# Altium schematic sheet Motors_Sheet.SchDoc
size A
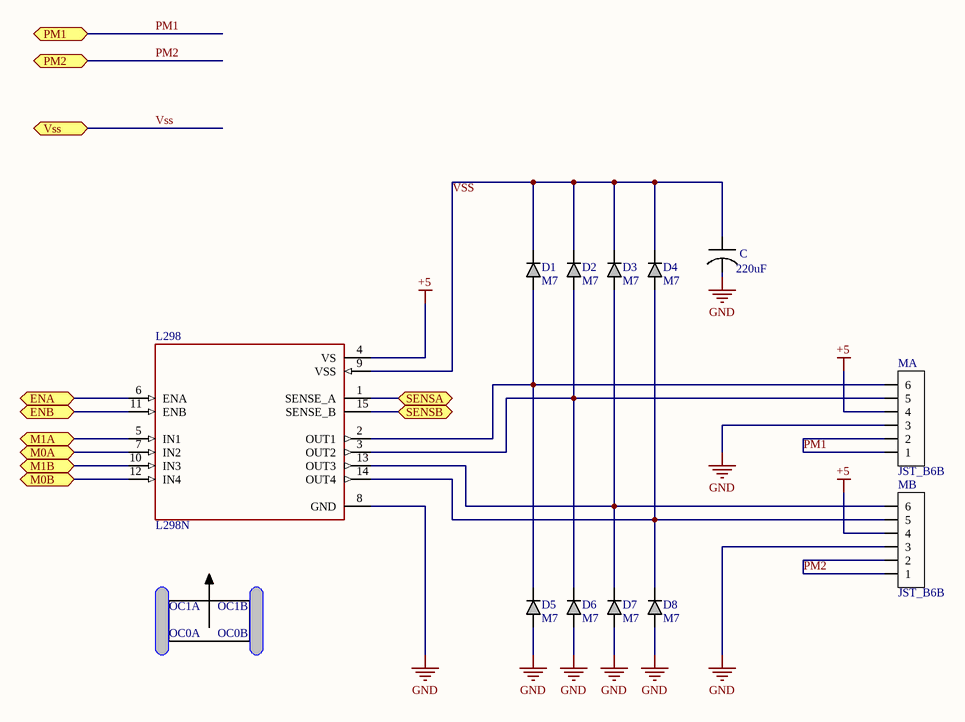
[diagram p0: Motors_Sheet.SchDoc]

## Parts
C  value 220uF  [CAP_8115]  (hidden comment: cap_elec8115)
D1  M7  [1N4007]
D2  M7  [1N4007]
D3  M7  [1N4007]
D4  M7  [1N4007]
D5  M7  [1N4007]
D6  M7  [1N4007]
D7  M7  [1N4007]
D8  M7  [1N4007]
L298  L298N  [L298N]
MA  JST_B6B  [JST_B6B]
MB  JST_B6B  [JST_B6B]

## Ports
ENA (bidir), ENB (bidir), M0A (bidir), M0B (bidir), M1A (bidir), M1B (bidir), PM1 (bidir), PM2 (bidir), SENSA (bidir), SENSB (bidir), Vss (bidir)

## Nets
+5: L298.4(VS) MA.4 MB.4
GND: C.neg D5.A D6.A D7.A D8.A L298.8(GND) MA.3 MB.3
ENA: L298.6(ENA) ; port ENA
ENB: L298.11(ENB) ; port ENB
M0A: L298.7(IN2) ; port M0A
M0B: L298.12(IN4) ; port M0B
M1A: L298.5(IN1) ; port M1A
M1B: L298.10(IN3) ; port M1B
PM1: MA.1 MA.2 ; port PM1
PM2: MB.1 MB.2 ; port PM2
SENSA: L298.1(SENSE_A) ; port SENSA
SENSB: L298.15(SENSE_B) ; port SENSB
VSS: C.pos D1.C D2.C D3.C D4.C L298.9(VSS) ; port Vss
NetD1_A: D1.A D5.C L298.2(OUT1) MA.6
NetD2_A: D2.A D6.C L298.3(OUT2) MA.5
NetD3_A: D3.A D7.C L298.13(OUT3) MB.6
NetD4_A: D4.A D8.C L298.14(OUT4) MB.5

## Notes on the sheet
- OC1A
- OC1B
- OC0A
- OC0B

## Library data of the parts
D1-D8 = 1N4007